# EasyEDA Pro project LUME_PEN_EasyEDA_Project_V1.2_2026-06-28.epro, board PCB6
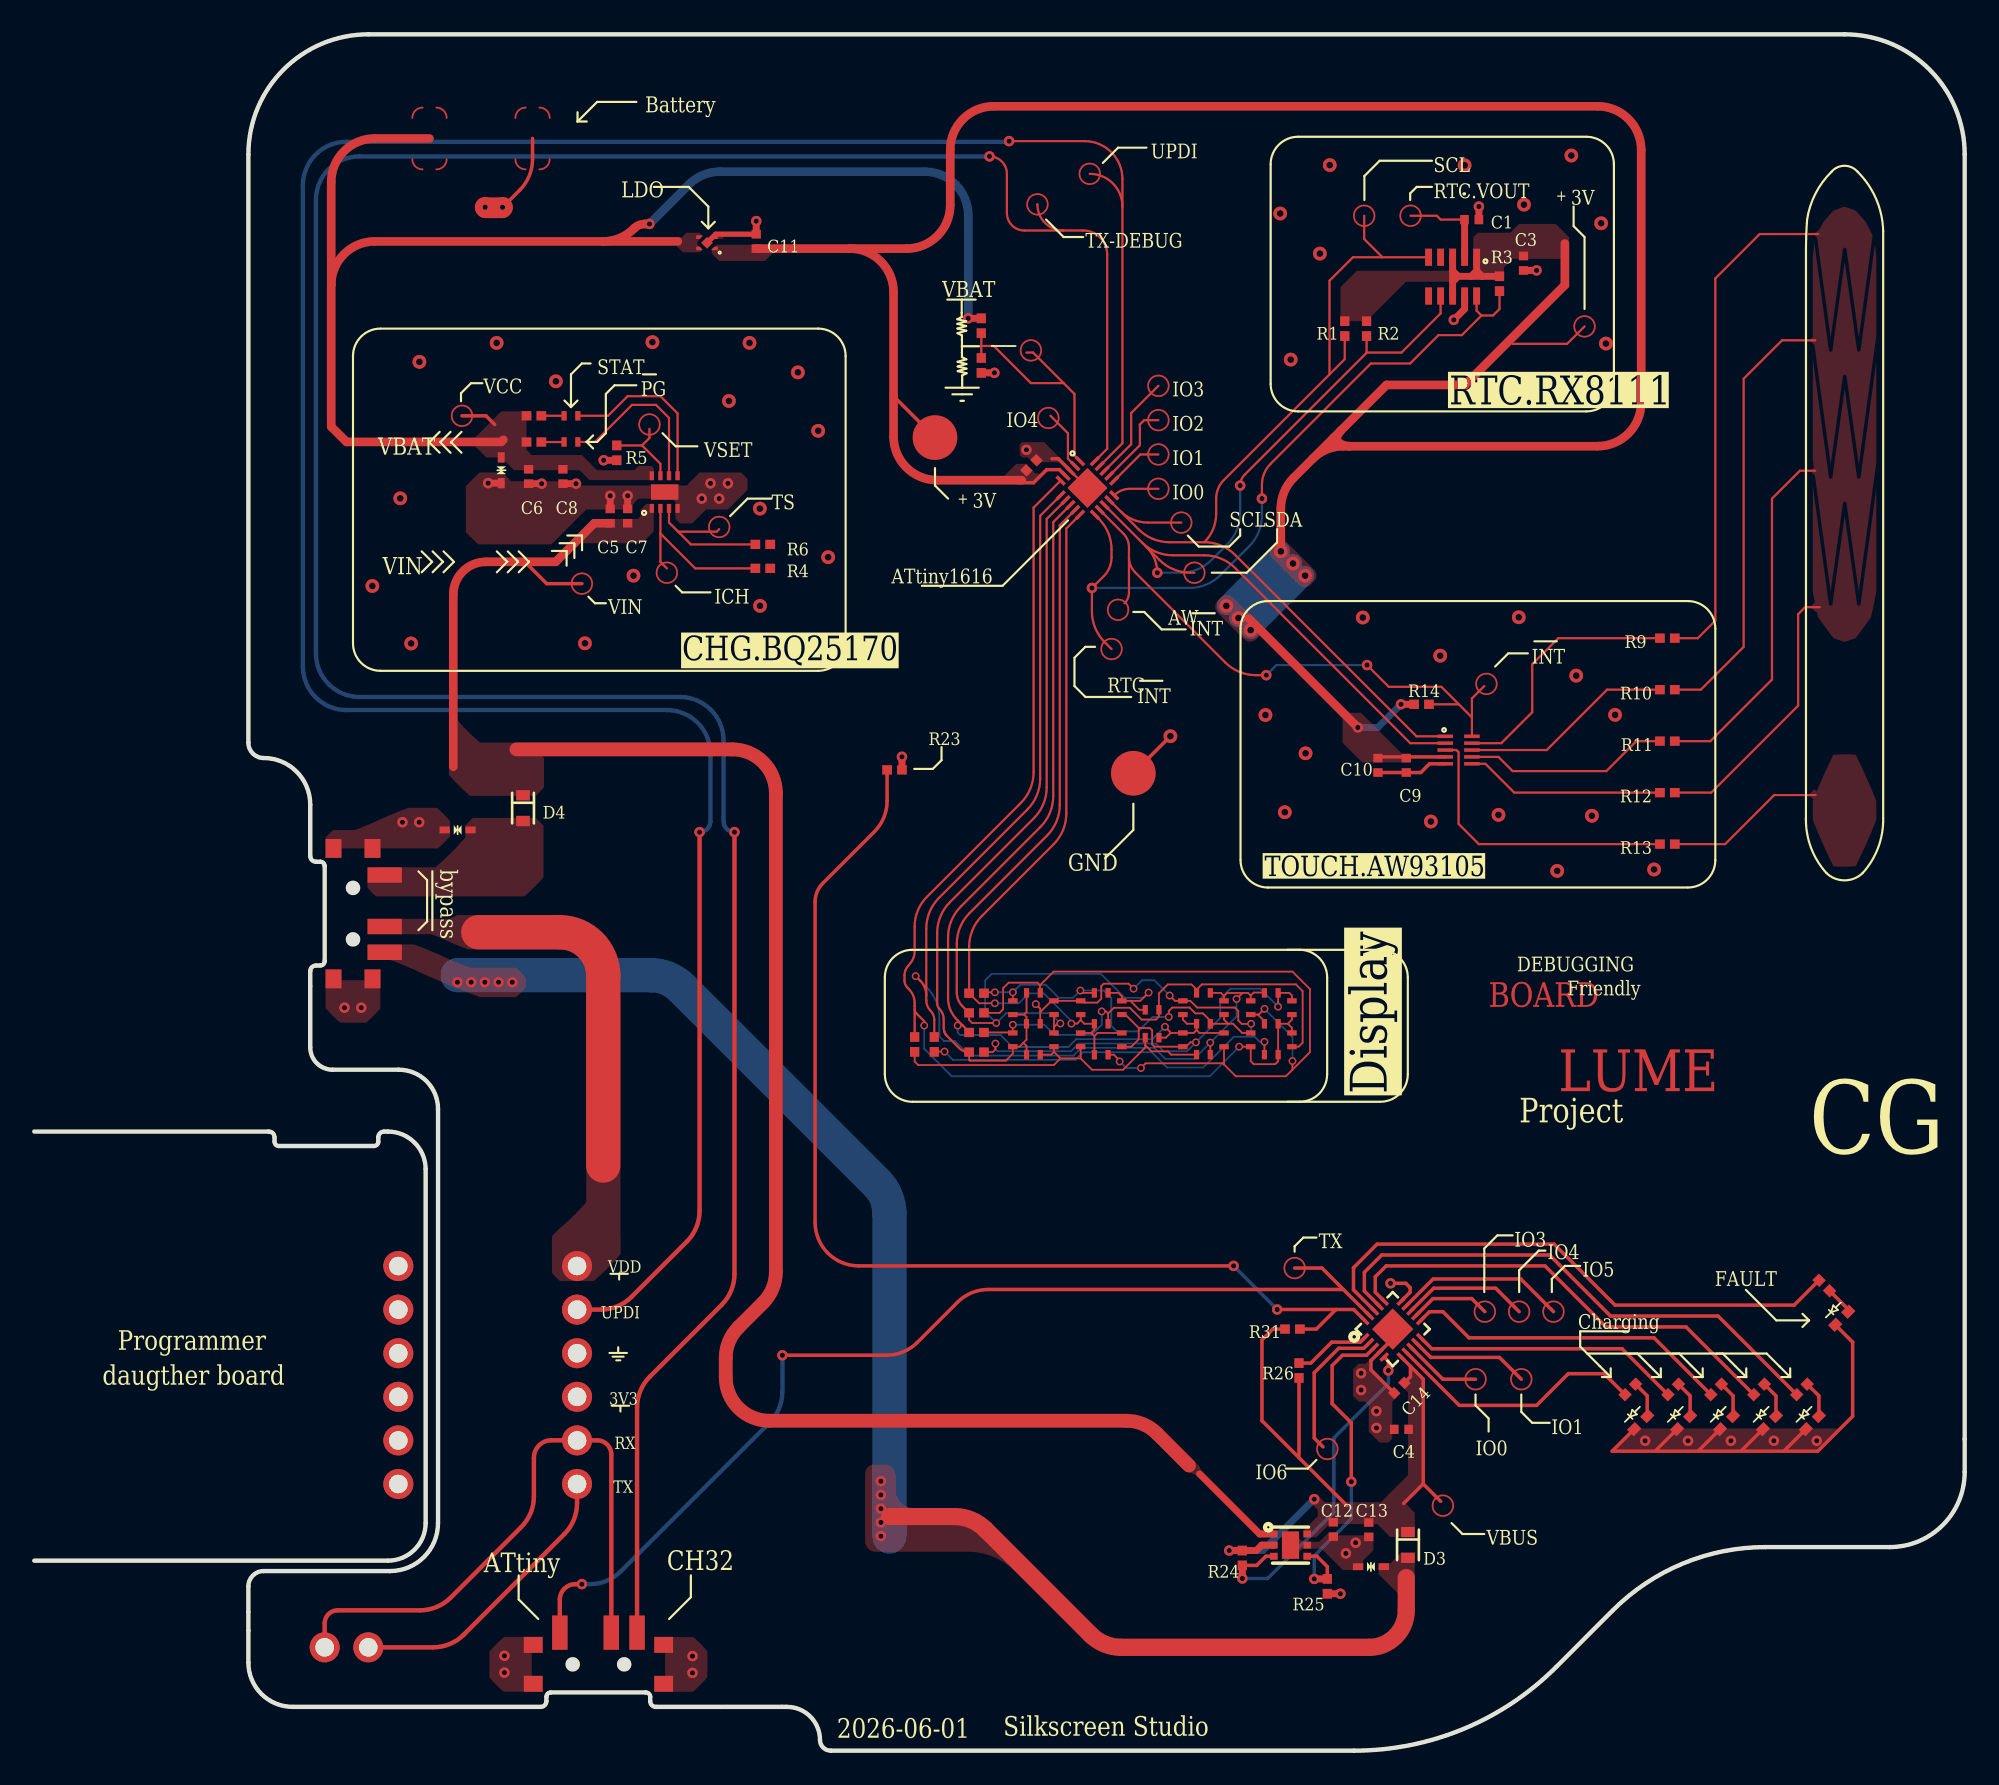
[diagram p7: board, top side]
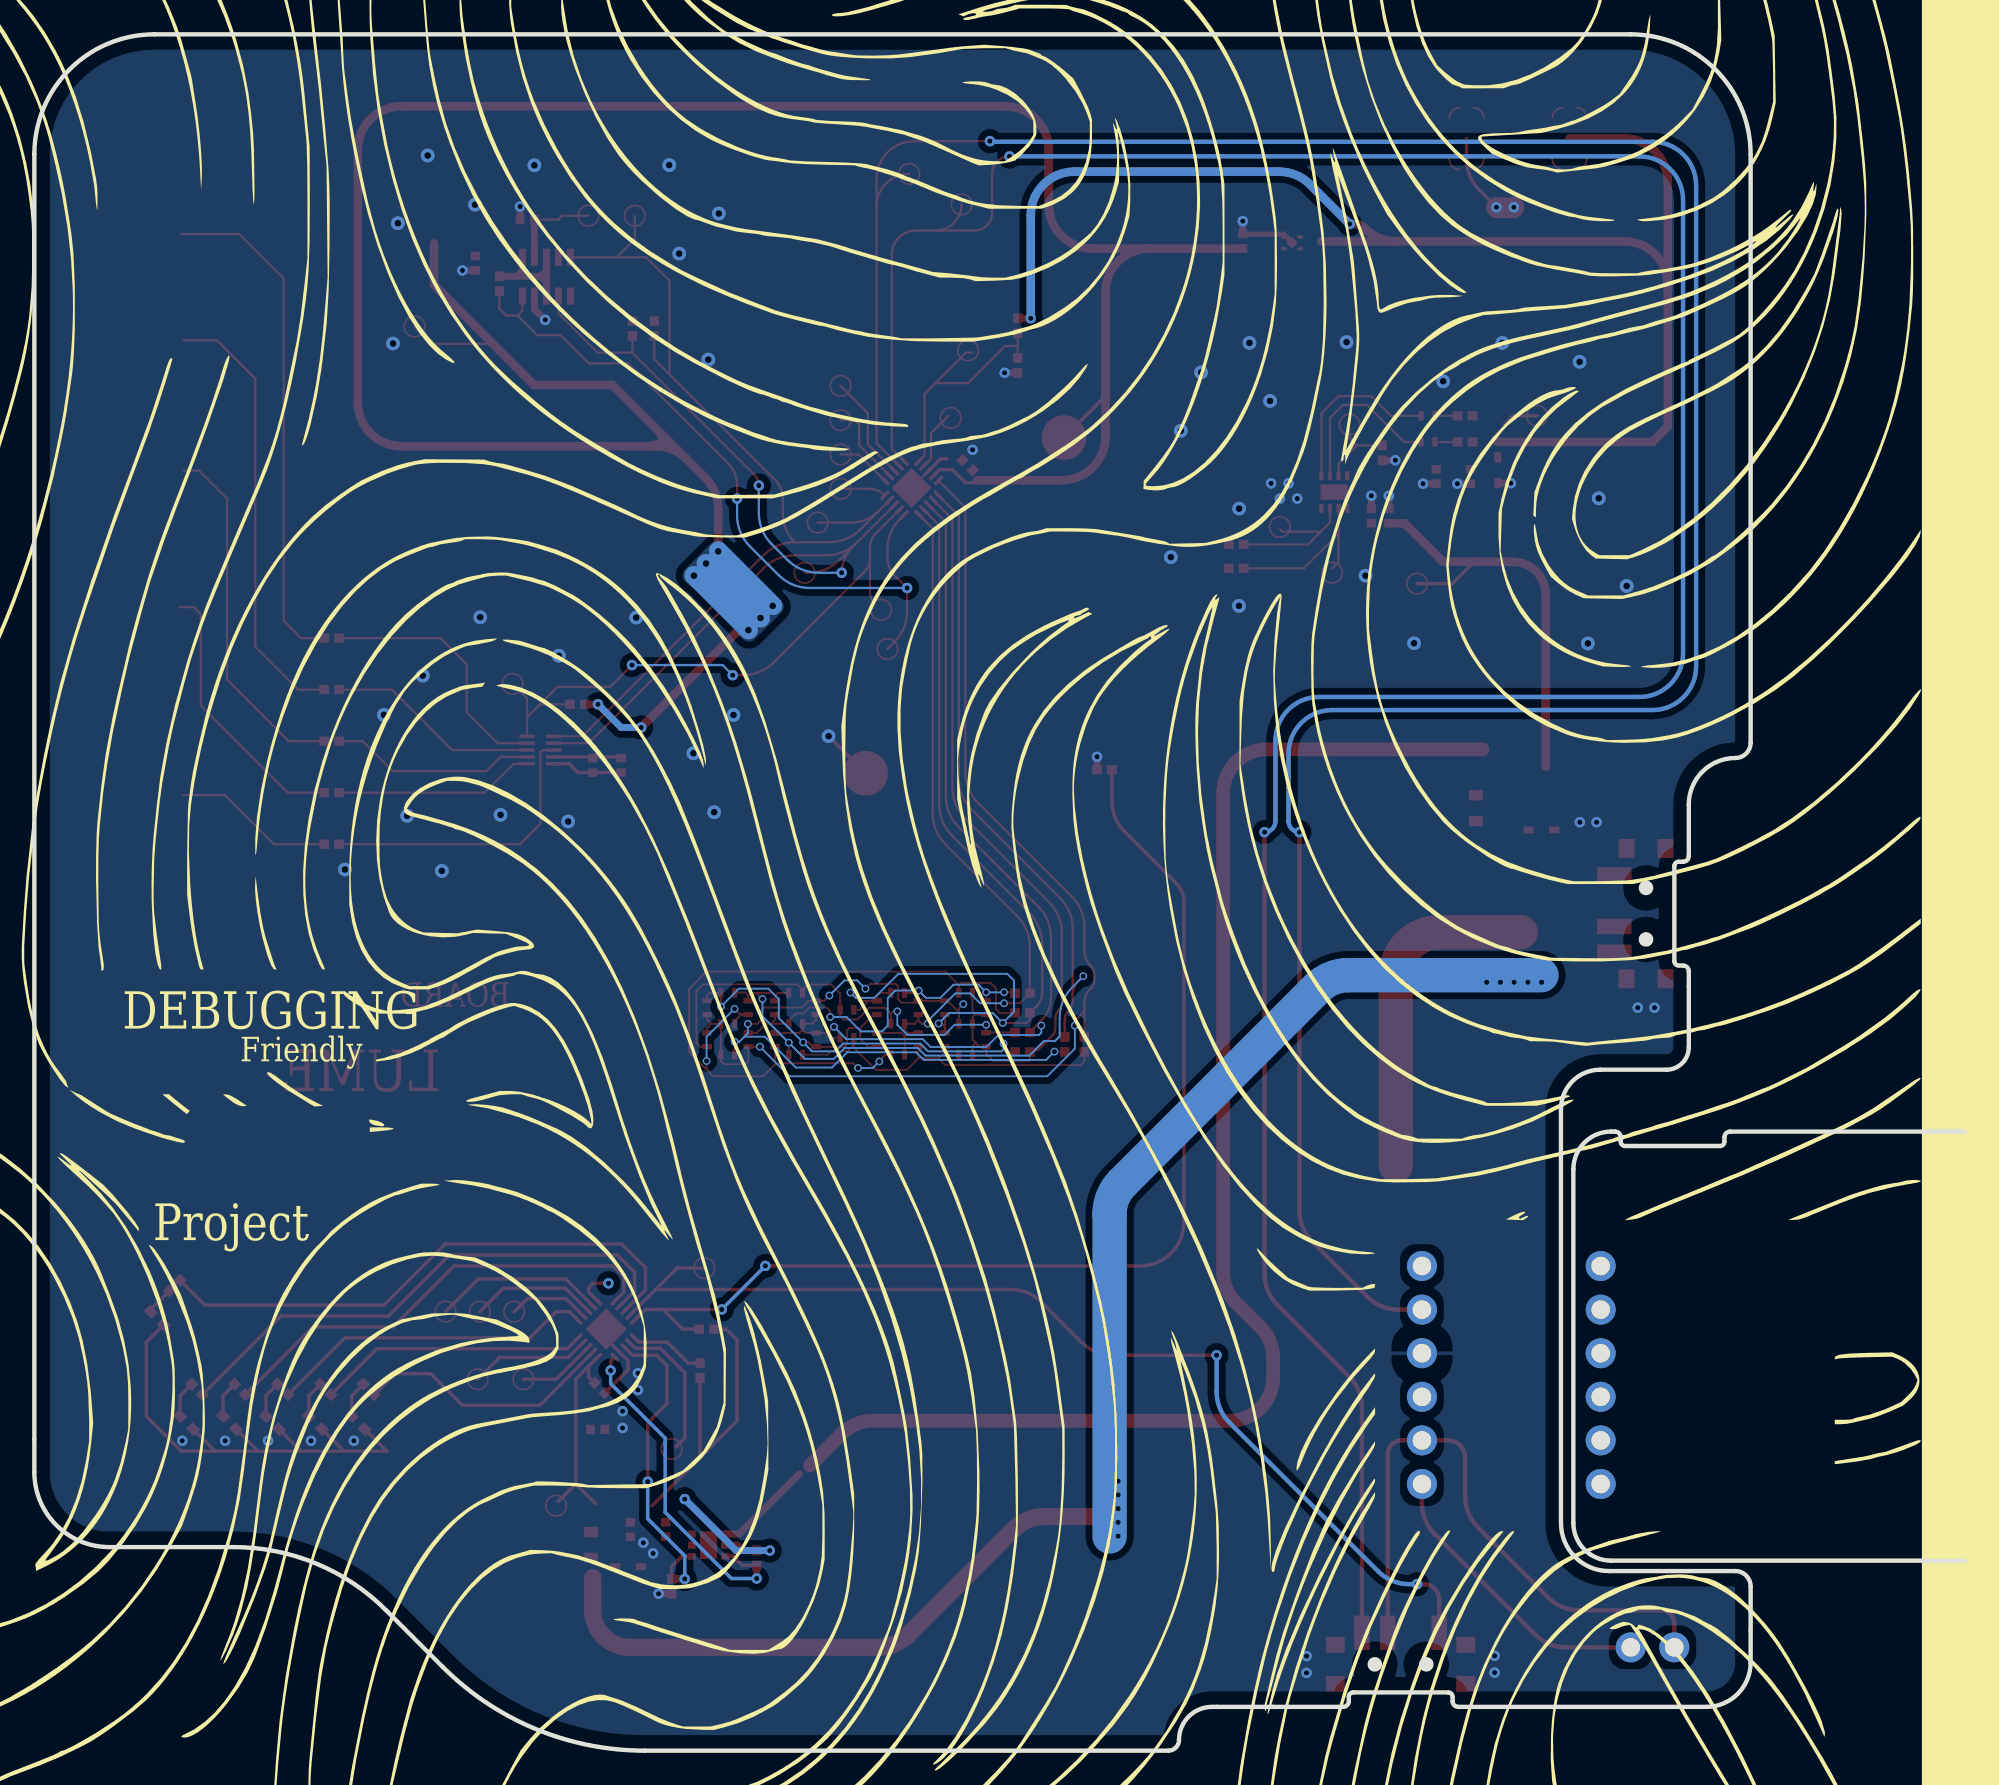
[diagram p8: board, bottom side, seen from below]

Outline 112.47 x 100 mm; copper layers: Top Layer, Bottom Layer. Coordinates in mm from the lower left corner of the outline.
Outline path: 0,36.07 13.66,36.07 arc(13.9,35.97) 14,35.74 14,35.48 arc(14.07,35.3) 14.25,35.23 19.79,35.23 arc(19.97,35.3) 20.04,35.48 20.04,35.74 arc(20.14,35.97) 20.38,36.07 20.6,36.07 arc(22.16,35.43) 22.8,33.87 22.8,13.27 arc(22.16,11.72) 20.6,11.07 0,11.07 ; 12.47,93 12.47,58.72 arc(12.73,58.1) 13.36,57.84 arc(15.28,57.04) 16.08,55.12 16.08,52.12 arc(16.17,51.89) 16.41,51.79 16.66,51.79 arc(16.84,51.72) 16.92,51.54 16.92,46 arc(16.84,45.82) 16.66,45.75 16.41,45.75 arc(16.17,45.65) 16.08,45.41 16.08,40.98 arc(16.46,40.06) 17.38,39.67 21.23,39.67 arc(22.85,39.01) 23.52,37.39 23.52,13.26 arc(22.7,11.28) 20.73,10.47 13.36,10.47 arc(12.73,10.2) 12.47,9.58 12.47,5.13 arc(13.23,3.31) 15.05,2.55 29.5,2.55 arc(29.74,2.65) 29.84,2.88 29.84,3.14 arc(29.91,3.32) 30.09,3.39 35.63,3.39 arc(35.81,3.32) 35.88,3.14 35.88,2.88 arc(35.98,2.65) 36.22,2.55 43.85,2.55 arc(45.21,1.99) 45.78,0.62 arc(45.96,0.18) 46.4,0 76.9,0 arc(83.27,1.27) 88.67,4.87 91.97,8.18 arc(96.05,10.9) 100.87,11.86 108.1,11.86 arc(111.19,13.14) 112.47,16.23 112.47,93 arc(110.42,97.95) 105.47,100 19.47,100 arc(14.52,97.95) 12.47,93
Stack: Top Layer 0.035mm / Dielectric1 1.51mm FR4 er 4.5 / Bottom Layer 0.035mm

## Design rules (mm)
template: Custom Config
spacing copperThickness1oz (default): track to track 0.127, other pairs 0.152 to 0.3
spacing copperThickness2oz: track to track 0.203, other pairs 0.152 to 0.3
track width copperThickness1oz (default): min 0.1, default 0.127, max 2.54
track width copperThickness2oz: min 0.203, default 0.254, max 2.54
differential pair differentialPair (default): width min 0.127, default 0.254, max 2.54; gap min 0.152, default 0.152
via viaSize (default): diameter min 0.45, default 0.61, max 10; hole min 0.3, default 0.305, max 6.3
net GND uses  MODULE_AREA_TOP_GND
pour e1174 uses  MODULE_AREA_TOP_GND

## Placement (name value [footprint] x y rotation side)
C1  1µF  [C0402]  83.75 89.2 0 top
C2  100nF  [C0402]  58.1 74.89 45 top
C3  100nF  [C0402]  86.77 86.66 270 top
C4  100nF  [C0402]  79.66 18.72 180 top
C5  4.7µF  [C0402]  33.55 71.93 90 top
C6  4.7µF  [C0402]  28.8 74.24 270 top
C7  100nF  [C0402]  34.57 71.93 90 top
C8  100nF  [C0402]  30.8 74.24 270 top
C9  100nF  [C0402]  79.94 57.41 270 top
C10  1µF  [C0402]  78.29 57.41 270 top
C11  1µF  [C0402]  42.06 87.94 90 top
C12  100nF  [C0402]  75.69 12.89 270 top
C13  10µF  [C0402]  77.75 12.88 270 top
C14  100nF  [C0402]  79.53 21.13 225 top
D1  LESD5D5.0CT1G  [SOD-523_L1.2-W0.8-LS1.6-BI]  27.2 74.6 90 top
D3  RB520SM-40T2R  [SOD-523F_L1.7-W0.9-LS1.7-RD]  80.04 11.99 270 top
D4  RB520SM-40T2R  [SOD-523F_L1.7-W0.9-LS1.7-RD]  28.47 54.91 270 top
LED1  XL-1005SURC  [LED0402]  31.27 76.25 180 top
LED2  XL-1005SURC  [LED0402]  31.27 77.77 180 top
LED3  XL-1005SURC  [LED0402]  63.37 43.29 270 top
LED4  XL-1005SURC  [LED0402]  63.36 41.42 270 top
LED5  XL-1005SURC  [LED0402]  66.92 41.42 270 top
LED6  XL-1005SURC  [LED0402]  72.07 44.15 0 top
LED7  XL-1005SURC  [LED0402]  73.27 43.29 90 top
LED8  XL-1005SURC  [LED0402]  58.21 44.15 0 top
LED9  XL-1005SURC  [LED0402]  62.16 40.55 0 top
LED10  XL-1005SURC  [LED0402]  69.32 41.42 270 top
LED11  XL-1005SURC  [LED0402]  70.87 43.29 270 top
LED12  XL-1005SURC  [LED0402]  72.07 42.35 180 top
LED13  XL-1005SURC  [LED0402]  57.01 43.29 90 top
LED14  XL-1005SURC  [LED0402]  62.16 44.15 180 top
LED15  XL-1005SURC  [LED0402]  68.12 42.35 0 top
LED16  XL-1005SURC  [LED0402]  69.32 43.29 270 top
LED17  XL-1005SURC  [LED0402]  70.87 41.42 90 top
LED18  XL-1005SURC  [LED0402]  57.01 41.42 90 top
LED19  XL-1005SURC  [LED0402]  65.13 43.17 0 top
LED20  XL-1005SURC  [LED0402]  62.16 42.35 0 top
LED21  XL-1005SURC  [LED0402]  68.12 44.15 180 top
LED22  XL-1005SURC  [LED0402]  73.27 41.42 270 top
LED23  XL-1005SURC  [LED0402]  58.21 42.36 0 top
LED24  XL-1005SURC  [LED0402]  59.41 43.29 90 top
LED25  XL-1005SURC  [LED0402]  60.97 43.29 90 top
LED26  XL-1005SURC  [LED0402]  66.92 43.29 90 top
LED27  XL-1005SURC  [LED0402]  72.07 40.55 180 top
LED28  XL-1005SURC  [LED0402]  58.21 40.55 0 top
LED29  XL-1005SURC  [LED0402]  59.41 41.42 270 top
LED30  XL-1005SURC  [LED0402]  60.96 41.42 270 top
LED31  XL-1005SURC  [LED0402]  65.13 41.54 180 top
LED32  XL-1005SURC  [LED0402]  68.12 40.55 180 top
LED33  XL-1005UWC  [LED0402-RD_YELLOW]  103.6 19.11 45 top
LED34  XL-1005UWC  [LED0402-RD_YELLOW]  101.1 19.11 45 top
LED35  XL-1005UWC  [LED0402-RD_YELLOW]  98.6 19.11 45 top
LED36  XL-1005UWC  [LED0402-RD_YELLOW]  96.1 19.11 45 top
LED37  XL-1005URC  [LED0402-RD_YELLOW]  105.31 25.2 45 top
LED38  XL-1005UWC  [LED0402-RD_YELLOW]  93.6 19.11 45 top
NOREF  -  [Pad_e428]  19.46 6.02 90 top
NOREF#2  -  [Pad_e1015]  63.15 66.47 0 top
NOREF#3  -  [Pad_e1182]  73.43 28.12 0 top
NOREF#4  -  [Pad_e1034]  39.9 71.3 0 top
NOREF#5  -  [Pad_e272]  82.07 14.28 0 top
NOREF#6  -  [Pad_e960]  84.61 62.15 0 top
NOREF#7  -  [Pad_e1010]  66.83 71.55 0 top
NOREF#8  -  [Pad_e1011]  67.59 68.63 0 top
NOREF#9  -  [Pad_e2385]  64.03 56.95 0 top
NOREF#10  -  [Pad_e260]  21.21 15.54 0 top
NOREF#11  -  [Pad_e2391]  52.48 76.5 0 top
NOREF#12  -  [Pad_e407]  31.62 15.54 0 top
NOREF#13  -  [Pad_e426]  31.62 28.24 0 top
NOREF#14  -  [Pad_e269]  21.21 25.7 0 top
NOREF#15  -  [Pad_e1650]  90.32 82.98 0 top
NOREF#16  -  [Pad_e1630]  77.48 89.43 0 top
NOREF#17  -  [Pad_e1123]  24.92 77.77 0 top
NOREF#18  -  [Pad_e1371]  58.06 81.58 0 top
NOREF#19  -  [Pad_e624]  86.64 21.64 0 top
NOREF#20  -  [Pad_e1033]  36.86 68.63 0 top
NOREF#21  -  [Pad_e1259]  65.49 75.52 0 top
NOREF#22  -  [Pad_e1261]  65.49 79.52 0 top
NOREF#23  -  [Pad_e1252]  84.51 25.58 0 top
NOREF#24  -  [Pad_e268]  21.21 23.16 0 top
NOREF#25  -  [Pad_e1024]  61.49 91.87 0 top
NOREF#26  -  [Pad_e266]  21.21 20.62 0 top
NOREF#27  -  [Pad_e425]  31.62 25.7 0 top
NOREF#28  -  [Pad_e28]  29.03 93.93 0 top
NOREF#29  -  [Pad_e423]  31.62 20.62 0 top
NOREF#30  -  [Pad_e265]  21.21 18.08 0 top
NOREF#31  -  [Pad_e1629]  80.18 89.43 0 top
NOREF#32  -  [Pad_e424]  31.62 23.16 0 top
NOREF#33  -  [Pad_e1023]  58.45 90.09 0 top
NOREF#34  -  [Pad_e420]  31.62 18.08 0 top
NOREF#35  -  [Pad_e1375]  59.08 77.65 0 top
NOREF#36  -  [Pad_e434]  16.92 6.02 90 top
NOREF#37  -  [Pad_e280]  21.21 28.24 0 top
NOREF#38  -  [Pad_e1128]  31.9 68 0 top
NOREF#39  -  [Pad_e1260]  65.49 77.52 0 top
NOREF#40  -  [Pad_e1765]  65.49 73.52 180 top
NOREF#41  -  [Pad_e27]  23.02 93.93 0 top
NOREF#42  -  [Pad_e1016]  62.76 64.19 0 top
NOREF#43  -  [Pad_e1253]  86.51 25.58 0 top
NOREF#44  -  [Pad_e1251]  88.51 25.58 0 top
NOREF#45  -  [Pad_e1035]  35.84 77.27 0 top
NOREF#46  -  [Pad_e622]  83.97 21.64 0 top
NOREF#47  -  [Pad_e1361]  75.34 17.58 0 top
R1  4.7K  [R0402]  76.35 82.86 90 top
R2  4.7K  [R0402]  77.62 82.86 90 top
R3  20K  [R0402]  85.37 85.47 90 top
R4  24K  [R0402]  42.44 68.88 180 top
R5  27K  [R0402]  33.94 75.62 90 top
R6  10K  [R0402]  42.44 70.28 180 top
R7  10K  [R0402]  29.11 76.25 180 top
R8  10K  [R0402]  29.11 77.77 180 top
R9  0  [R0402]  95.15 64.82 180 top
R10  0  [R0402]  95.15 61.82 180 top
R11  0  [R0402]  95.15 58.82 180 top
R12  0  [R0402]  95.15 55.82 180 top
R13  0  [R0402]  95.15 52.82 0 top
R14  20K  [R0402]  80.83 60.97 180 top
R15  680  [R0402]  54.9 40.7 180 top
R16  680  [R0402]  54.9 42.99 180 top
R17  680  [R0402]  54.9 44.13 180 top
R18  680  [R0402]  54.9 41.84 180 top
R19  680  [R0402]  52.44 41.15 90 top
R20  680  [R0402]  51.29 41.15 90 top
R21  100K  [R0402]  55.18 83.02 90 top
R22  200K  [R0402]  55.18 80.71 90 top
R23  20K  [R0402]  50.12 57.14 180 top
R24  100K  [R0402]  70.38 11.23 90 top
R25  20K  [R0402]  75.34 9.58 90 top
R26  10K  [R0402]  73.69 22.15 270 top
R27  330  [R0402]  102.99 21.05 45 top
R28  330  [R0402]  100.49 21.05 45 top
R29  330  [R0402]  97.99 21.05 45 top
R30  330  [R0402]  95.49 21.05 45 top
R31  20K  [R0402]  73.31 24.56 180 top
R32  330  [R0402]  104.29 27.1 315 top
R33  330  [R0402]  92.99 21.05 45 top
SW3  MK-12C02-G015  [SW-SMD_G-SWITCH_MK-12C02-G015]  18.92 48.77 270 top
SW4  MK-12C02-G015  [SW-SMD_G-SWITCH_MK-12C02-G015]  32.87 5.38 0 top
TVS1  LESD5D5.0CT1G  [SOD-523_L1.2-W0.8-LS1.6-BI]  77.88 10.72 0 top
TVS2  LESD5D5.0CT1G  [SOD-523_L1.2-W0.8-LS1.6-BI]  24.66 53.64 0 top
U1  RX8111CE B  [OSC-SMD_10P-L3.2-W2.5-BL-1]  82.64 85.88 180 top
U2  ATTINY1616-MNR  [QFN-20_L3.0-W3.0-P0.40-BL-EP1.7]  61.36 73.57 225 top
U3  BQ25170DSGR  [WSON-8_L2.0-W2.0-P0.50-TL-EP]  36.73 73.33 90 top
U4  -  [AW93105DNR]  82.98 58.3 270 top
U5  LP5907SNX-3.0/NOPB  [X2SON-4_L1.0-W1.0-P0.65-BL-EP]  39.19 87.85 90 top
U6  TPS2553DRVR-1  [WSON-6_L2.0-W2.0-P0.65-BL-EP]  73.19 11.98 270 top
U7  CH32V003F4U6  [QFN-20_L3.0-W3.0-P0.40-TL-EP1.7]  79.15 24.56 45 top

## Footprints (pads in the part's own frame, mm; a bottom-side part is the same pattern mirrored in y, then rotated)
AW93105DNR
  rect 0.2x0.905 smd: 1(-0.8,-0.777) 2(-0.4,-0.777) 3(0,-0.777) 4(0.4,-0.777) 5(0.8,-0.777) 6(0.8,0.777) 7(0.4,0.777) 8(0,0.777) 9(-0.4,0.777) 10(-0.8,0.777)
C0402
  rect 0.5x0.54 smd: 1(-0.42,0) 2(0.42,0)
LED0402
  rect 0.3x0.55 smd: 1(-0.4,0) 2(0.4,0)
LED0402-RD_YELLOW
  rect 0.636x0.54 smd: 1(-0.538,0) 2(0.538,0)
OSC-SMD_10P-L3.2-W2.5-BL-1
  rect 0.4x1 smd: 1(-1.4,-1.13) 2(-0.7,-1.13) 3(0,-1.13) 4(0.7,-1.13) 5(1.4,-1.13) 6(1.4,1.13) 7(0.7,1.13) 8(0,1.13) 9(-0.7,1.13) 10(-1.4,1.13)
Pad_e27
  custom 2x3.6 smd: 24(0,0)
Pad_e28
  custom 2x3.6 smd: 25(0,0)
Pad_e260
  rrect 1.75x1.75 hole 1.08: 4(0,0)
Pad_e265
  rrect 1.75x1.75 hole 1.08: 5(0,0)
Pad_e266
  rrect 1.75x1.75 hole 1.08: 5(0,0)
Pad_e268
  rrect 1.75x1.75 hole 1.08: 3(0,0)
Pad_e269
  rrect 1.75x1.75 hole 1.08: 2(0,0)
Pad_e272
  custom 1.2x1.2 smd: 23(0,0)
Pad_e280
  rrect 1.75x1.75 hole 1.08: 2(0,0)
Pad_e407
  rrect 1.75x1.75 hole 1.08: 4(0,0)
Pad_e420
  rrect 1.75x1.75 hole 1.08: 5(0,0)
Pad_e423
  rrect 1.75x1.75 hole 1.08: 5(0,0)
Pad_e424
  rrect 1.75x1.75 hole 1.08: 3(0,0)
Pad_e425
  rrect 1.75x1.75 hole 1.08: 2(0,0)
Pad_e426
  rrect 1.75x1.75 hole 1.08: 2(0,0)
Pad_e428
  rrect 1.75x1.75 hole 1.08: 4(0,0)
Pad_e434
  rrect 1.75x1.75 hole 1.08: 5(0,0)
Pad_e622
  custom 1.2x1.2 smd: 23(0,0)
Pad_e624
  custom 1.2x1.2 smd: 23(0,0)
Pad_e960
  custom 1.2x1.2 smd: 23(0,0)
Pad_e1010
  custom 1.2x1.2 smd: 22(0,0)
Pad_e1011
  custom 1.2x1.2 smd: 22(0,0)
Pad_e1015
  custom 1.2x1.2 smd: 22(0,0)
Pad_e1016
  custom 1.2x1.2 smd: 22(0,0)
Pad_e1023
  custom 1.2x1.2 smd: 22(0,0)
Pad_e1024
  custom 1.2x1.2 smd: 22(0,0)
Pad_e1033
  custom 1.2x1.2 smd: 1(0,0)
Pad_e1034
  custom 1.2x1.2 smd: 22(0,0)
Pad_e1035
  custom 1.2x1.2 smd: 23(0,0)
Pad_e1123
  custom 1.2x1.2 smd: 23(0,0)
Pad_e1128
  custom 1.2x1.2 smd: 23(0,0)
Pad_e1182
  custom 1.2x1.2 smd: 23(0,0)
Pad_e1251
  custom 1.2x1.2 smd: 23(0,0)
Pad_e1252
  custom 1.2x1.2 smd: 23(0,0)
Pad_e1253
  custom 1.2x1.2 smd: 23(0,0)
Pad_e1259
  custom 1.2x1.2 smd: 22(0,0)
Pad_e1260
  custom 1.2x1.2 smd: 22(0,0)
Pad_e1261
  custom 1.2x1.2 smd: 22(0,0)
Pad_e1361
  custom 1.2x1.2 smd: 23(0,0)
Pad_e1371
  custom 1.2x1.2 smd: 22(0,0)
Pad_e1375
  custom 1.2x1.2 smd: 22(0,0)
Pad_e1629
  custom 1.2x1.2 smd: 23(0,0)
Pad_e1630
  custom 1.2x1.2 smd: 23(0,0)
Pad_e1650
  custom 1.2x1.2 smd: 23(0,0)
Pad_e1765
  custom 1.2x1.2 smd: 22(0,0)
Pad_e2385
  round 2.6 smd: 2(0,0)
Pad_e2391
  round 2.6 smd: 2(0,0)
QFN-20_L3.0-W3.0-P0.40-BL-EP1.7
  rect 0.2x0.665 smd: 1(-0.8,-1.407) 2(-0.4,-1.407) 3(0,-1.407) 4(0.4,-1.407) 5(0.8,-1.407) 11(0.8,1.407) 12(0.4,1.407) 13(0,1.407) 14(-0.4,1.407) 15(-0.8,1.407)
  rect 0.665x0.2 smd: 6(1.407,-0.8) 7(1.407,-0.4) 8(1.407,0) 9(1.407,0.4) 10(1.407,0.8) 16(-1.407,0.8) 17(-1.407,0.4) 18(-1.407,0) 19(-1.407,-0.4) 20(-1.407,-0.8)
  rect 1.65x1.65 smd: 21(0,0)
QFN-20_L3.0-W3.0-P0.40-TL-EP1.7
  rect 0.6x0.2 smd: 1(-1.5,0.8) 2(-1.5,0.401) 3(-1.5,0) 4(-1.5,-0.4) 5(-1.5,-0.8) 11(1.5,-0.8) 12(1.5,-0.4) 13(1.5,0) 14(1.5,0.401) 15(1.5,0.8)
  rect 0.2x0.6 smd: 6(-0.8,-1.5) 7(-0.4,-1.5) 8(0,-1.5) 9(0.4,-1.5) 10(0.799,-1.5) 16(0.8,1.5) 17(0.4,1.5) 18(0,1.5) 19(-0.4,1.5) 20(-0.8,1.5)
  rect 1.7x1.7 smd: 21(0,0)
R0402
  rect 0.566x0.54 smd: 1(-0.433,0) 2(0.433,0)
SOD-523_L1.2-W0.8-LS1.6-BI
  rect 0.6x0.4 smd: 1(-0.75,0) 2(0.75,0)
SOD-523F_L1.7-W0.9-LS1.7-RD
  rect 0.6x0.8 smd: 1(-0.75,0) 2(0.75,0)
SW-SMD_G-SWITCH_MK-12C02-G015
  rect 0.9x2 smd: 1(-2.25,1.49) 2(0.75,1.49) 3(2.25,1.49)
  rect 1.1x0.93 smd: 4(3.8,0.779) 5(3.8,-1.49) 6(-3.8,-1.49) 7(-3.8,0.779)
WSON-6_L2.0-W2.0-P0.65-BL-EP
  rect 0.4x0.45 smd: 1(-0.65,-0.975) 2(0,-0.975) 3(0.65,-0.975) 4(0.65,0.975) 5(0,0.975) 6(-0.65,0.975)
  rect 1.6x1 smd: 7(0,0)
WSON-8_L2.0-W2.0-P0.50-TL-EP
  rect 0.521x0.25 smd: 1(-0.95,0.75) 2(-0.95,0.25) 3(-0.95,-0.25) 4(-0.95,-0.75) 5(0.95,-0.75) 6(0.95,-0.25) 7(0.95,0.25) 8(0.95,0.75)
  rect 0.9x1.6 smd: 9(0,0)
X2SON-4_L1.0-W1.0-P0.65-BL-EP
  custom 0.21x0.36 smd: 1(-0.33,-0.45) 2(0.33,-0.45) 3(0.33,0.45) 4(-0.33,0.45)
  rect 0.48x0.48 smd rot 135: 5(0,0)

## Nets
3.0V: C2.1 C3.1 C9.1 C10.1 C11.1 NOREF#11.2 NOREF#15.23 R1.2 R2.2 R3.2 R14.2 U1.1 U1.3 U1.8 U2.4 U4.4 U5.1
5V_IN: D3.2 SW3.3 TVS1.2
5V_POGO_EN: R25.2 U6.4 U7.3
+3.3V: NOREF#26.5 NOREF#29.5
GND: C1.2 C2.2 C3.2 C4.2 C5.2 C6.2 C7.2 C8.2 C9.2 C10.2 C11.2 C12.2 C13.2 C14.2 D1.1 LED33.1 LED34.1 LED35.1 LED36.1 LED37.1 LED38.1 NOREF#9.2 NOREF#24.3 NOREF#28.25 NOREF#32.3 R4.1 R5.1 R6.1 R22.1 R23.1 R25.1 SW3.4 SW3.5 SW3.6 SW3.7 SW4.4 SW4.5 SW4.6 SW4.7 TVS1.1 TVS2.1 U1.9 U2.3 U2.21 U3.4 U3.9 U4.5 U5.2 U5.5 U6.5 U6.7 U7.4 U7.21
VBAT.SENSE: NOREF#18.22 R21.1 R22.2 U2.1
VBUS: C4.1 C12.1 C13.1 C14.1 D3.1 NOREF#5.23 R24.2 R26.2 R31.2 U6.2 U6.6 U7.6
VCC: C6.1 C8.1 D1.2 NOREF#17.23 NOREF#41.24 R7.2 R8.2 R21.2 U3.8 U5.3 U5.4
VDD.DEBUG: NOREF#13.2 NOREF#37.2 SW3.2
VIN: C5.1 C7.1 D4.1 NOREF#38.23 U3.1 U6.1
VIN.USB: D4.2 SW3.1 TVS2.2
AW.NINT: NOREF#2.22 NOREF#6.23 R14.1 U2.12 U4.10
C0: R11.1
C1: R12.1
C2: R13.2
C3: R10.1
C4: R9.1
DEBUG.TX: NOREF#33.22 SW4.3 U2.20
DEBUG.TX.CHG: NOREF#3.23 SW4.1 U7.19
DEBUG.TX.PROBE: NOREF#30.5 NOREF#34.5 NOREF#36.5 SW4.2
EVIN: U1.6
GPIO0: NOREF#40.22 U2.15
GPIO1: NOREF#21.22 U2.16
GPIO2: NOREF#39.22 U2.17
GPIO3: NOREF#22.22 U2.18
GPIO4: NOREF#35.22 U2.2
IO0: NOREF#46.23 U7.8
IO1: NOREF#19.23 U7.9
IO3: NOREF#23.23 U7.12
IO4: NOREF#43.23 U7.13
IO5: NOREF#44.23 U7.14
IO6: NOREF#47.23 U7.2
L1: LED8.1 LED13.1 LED18.1 LED23.1 LED28.1 R15.2 U2.7
L2: LED3.1 LED14.1 LED19.1 LED24.1 LED29.1 R16.2 U2.9
L3: LED4.1 LED9.1 LED20.1 LED25.1 LED30.1 R17.2 U2.10
L4: LED5.1 LED10.1 LED15.1 LED26.1 LED31.1 R18.2 U2.8
L5: LED6.1 LED11.1 LED16.1 LED21.1 LED32.1 R19.2 U2.6
L6: LED7.1 LED12.1 LED17.1 LED22.1 LED27.1 R20.2 U2.5
LED_R: R32.1 U7.18
LED_W1: R33.1 U7.7
LED_W2: R27.1 U7.17
LED_W3: R28.1 U7.16
LED_W4: R29.1 U7.11
LED_W5: R30.1 U7.10
NFAULT: R24.1 U6.3 U7.5
RTC.NINT: NOREF#42.22 R3.1 U1.10 U2.11
RTC.VOUT: C1.1 NOREF#31.23 U1.2
SCL: NOREF#7.22 NOREF#16.23 R1.1 U1.5 U2.14 U4.1
SDA: NOREF#8.22 R2.1 U1.7 U2.13 U4.2
SENSE: R23.2 R31.1 U7.20
SWIO: U7.15
TX: NOREF.4 NOREF#10.4 NOREF#12.4
UPDI: NOREF#14.2 NOREF#25.22 NOREF#27.2 U2.19
VSET: NOREF#45.23 R5.2 U3.7
$1N3166: NOREF#20.1 R4.2 U3.2
$1N3167: NOREF#4.22 R6.2 U3.3
$1N3187: LED2.2 R8.1
$1N3197: LED2.1 U3.5
$1N3198: LED1.2 R7.1
$1N3199: LED1.1 U3.6
$1N3232: R12.2 U4.6
$1N3233: R11.2 U4.7
$1N3236: R10.2 U4.8
$1N3237: R9.2 U4.9
$1N3255: R13.1 U4.3
$1N4483: R26.1 U7.1
$1N4489: LED38.2 R33.2
$1N4492: LED33.2 R27.2
$1N4495: LED34.2 R28.2
$1N4498: LED35.2 R29.2
$1N4501: LED36.2 R30.2
$1N4505: LED37.2 R32.2
$1N4813: LED3.2 LED4.2 LED5.2 LED6.2 LED7.2 R15.1
$1N4816: LED8.2 LED9.2 LED10.2 LED11.2 LED12.2 R16.1
$1N4817: LED18.2 LED19.2 LED20.2 LED21.2 LED22.2 R18.1
$1N4818: LED13.2 LED14.2 LED15.2 LED16.2 LED17.2 R17.1
$1N4825: LED23.2 LED24.2 LED25.2 LED26.2 LED27.2 R19.1
$1N5378: LED28.2 LED29.2 LED30.2 LED31.2 LED32.2 R20.1

Pads without a net: U1 4

## Via types
v1: diameter 0.61, hole 0.305, Top Layer to Bottom Layer, 74 vias
v2: diameter 0.8, hole 0.4, Top Layer to Bottom Layer, 45 vias
v3: diameter 0.45, hole 0.3, Top Layer to Bottom Layer, 31 vias

## Routing (per net, layer and track width the routed paths; a pad name or vN(x,y) marks a point on that pad's centre or on a via; arc(x,y) is an arc through that point)
3.0V: length 193.9
  Top Layer w0.127: NOREF#15.23 89.31,81.97 86.13,81.97
  Top Layer w0.2: NOREF#11.2 50.06,78.92 ; U2.4 59.73,74.64 58.99,74.64 58.22,73.88 57.45,73.88 57.3,74.02 ; 78.29,57.83 78.35,57.9 U4.4
  Top Layer w0.4: 82.64,86.22 U1.3 ; 82.64,86.22 82.64,85.58 ; 82.64,86.22 82.96,85.9 ; 82.64,85.58 82.96,85.9 ; 82.64,85.58 U1.8 ; v1(79.63,60.97) R14.2 ; 82.96,85.9 83.72,85.9 ; 85.37,85.95 85.32,85.9 84.35,85.9 ; 84.04,86.22 U1.1 ; 84.04,86.22 84.35,85.9 ; 84.04,86.22 83.72,85.9 ; 84.35,85.9 83.72,85.9
  Top Layer w0.5: 75.71,76.49 74.47,75.26 ; 75.71,76.49 75.88,76.32 ; 75.71,76.49 76.12,76.9 ; 74.47,75.26 73.37,74.16 arc(72.82,73.33) 72.63,72.36 v2(72.63,69.87) ; 74.47,75.26 arc(75.3,75.81) 76.27,76 76.65,76 ; 89.18,87.81 89.18,85.39 83.36,79.57 78.78,79.57 76.12,76.9 ; v1(77.12,59.61) 70.76,65.96 ; 76.65,76 91.09,76 arc(92.88,76.75) 93.62,78.54 93.62,93.27 arc(92.88,95.07) 91.09,95.81 55.91,95.81 arc(54.11,95.07) 53.37,93.27 53.37,90.06 arc(52.62,88.26) 50.83,87.52 47.52,87.52 ; 76.65,76 arc(76.23,76.09) 75.88,76.32 ; 57.54,74.02 52.6,74.02 arc(50.81,74.77) 50.06,76.56 50.06,84.97 arc(49.32,86.77) 47.52,87.52 ; 75.88,76.32 arc(75.94,76.64) 76.12,76.9 ; C11.1 47.52,87.52
  Bottom Layer w0.4: v1(77.12,59.61) 78.28,59.61 v1(79.63,60.97)
  Bottom Layer w1.1: v2(70.16,65.99) v2(73.33,69.17) ; 70.86,65.3 74.04,68.48 ; 69.45,66.72 72.62,69.89
  vias: v2(69.45,66.7) v2(70.87,65.28) v2(74.04,68.46)
5V_IN: length 86.3
  Top Layer w1: 49.84,13.64 53.61,13.64 arc(54.58,13.45) 55.41,12.9 61.54,6.76 arc(62.36,6.21) 63.34,6.02 77.78,6.02 arc(79.3,6.65) 79.94,8.18 79.94,10.08
  Bottom Layer w2: 49.82,12.48 49.82,31.28 arc(49.63,32.25) 49.08,33.08 37.71,44.44 arc(36.89,44.99) 35.92,45.19 24.66,45.19
  vias: v1(24.65,44.77) v1(25.45,44.77) v1(26.25,44.77) v1(27.05,44.77) v1(27.85,44.77) v1(49.33,15.7) v1(49.33,14.9) v1(49.33,14.1) v1(49.33,13.3) v1(49.33,12.5)
5V_POGO_EN: length 19.6
  Top Layer w0.2: 78.09,23.5 77.62,23.04 76.22,23.04 75.62,22.44 75.62,20.22 76.73,19.1 v1(76.73,15.67) ; U6.4 74.73,11.33 75.34,10.72 R25.2
  Top Layer w0.4: v1(74.57,10.01) R25.2
  Bottom Layer w0.2: v1(74.57,10.01) 74.57,11.35 76.73,13.51 v1(76.73,15.67)
GND: length 64
  Top Layer w0.127: U2.3 U2.21
  Top Layer w0.2: 59.3,75.27 59.66,75.27 U2.3 ; v2(66.19,59.11) 64.67,57.58 63.78,57.58 ; U7.21 79.15,24 U7.4 77.88,22.73 77.88,22.19 C14.2 ; LED33.1 101.94,17.45 ; 101.94,17.45 103.91,17.45 105.94,19.48 105.94,23.8 LED37.1 ; 101.94,17.45 99.44,17.45 ; 96.94,17.45 94.44,17.45 ; 96.94,17.45 99.44,17.45 ; 96.94,17.45 LED35.1 ; 94.44,17.45 91.94,17.45 LED38.1 ; 94.44,17.45 LED36.1 ; 99.44,17.45 LED34.1 ; U4.5 81.29,57.5 80.79,56.99 C9.2 C10.2 ; NOREF#28.25 29.03,92.72 arc(28.83,91.75) 28.28,90.93 v1(27.28,89.92)
  Top Layer w0.3: C11.2 39.7,88.35 U5.5
  Top Layer w0.4: v1(76.1,9.14) R25.1 ; 86.77,86.25 v1(87.53,86.25) ; v1(29.56,73.82) C6.2 ; v1(31.56,73.82) C8.2 ; v1(50.55,57.91) R23.1 ; v1(26.44,73.85) D1.1 ; 58.39,75.21 58.39,75.19 ; v1(33.17,75.18) R5.1 ; v1(33.55,73.11) C5.2 ; v1(55.94,80.28) R22.1 ; v1(84.17,89.97) C1.2 ; v1(34.57,73.11) C7.2 ; v1(82.7,83.36) 83.34,84 U1.9 ; v1(42.06,89.12) C11.2
  Top Layer w1.2: v1(27.28,89.92) 27.25,89.89 26.3,89.89 v1(26.27,89.92)
  vias: v1(18.07,43.29) v1(19.05,43.29) v1(21.45,54.09) v1(22.43,54.09) v1(27.39,5.53) v1(27.39,4.55) v1(38.35,5.51) v1(38.35,4.53) v1(38.89,72.95) v1(39.4,73.84) v1(39.9,72.95) v1(40.41,73.84) v1(57.81,75.79) v1(76.42,11.49) v1(76.99,12.12) v1(77.31,21.99) v1(77.31,21.01) v1(78.2,19.78) v1(78.2,18.8) v1(93.85,18.06) v1(96.35,18.06) v1(98.85,18.06) v1(101.35,18.06) v1(103.85,18.06) v2(19.7,67.86) v2(21.32,72.97) v2(21.95,64.51) v2(22.44,80.92) v2(26.94,82.02) v2(30.39,79.78) v2(32.08,64.52) v2(34.91,68.46) v2(36.02,82.07) v2(40.47,78.64) v2(41.67,82.02) v2(42.28,72.37) v2(42.28,66.7) v2(44.49,80.3) v2(45.67,76.9) v2(46.25,69.54) v2(71.73,60.34) v2(72.59,89.56) v2(72.86,54.68) v2(73.2,81.05) v2(74.07,58.11) v2(74.9,87.22) v2(75.48,92.38) v2(77.4,66.02) v2(81.37,54.14) v2(81.91,63.8) v2(83.34,92.37) v2(85.31,54.52) v2(86.49,66.04) v2(86.79,90.08) v2(88.73,51.26) v2(89.55,92.94) v2(89.84,62.64) v2(90.75,54.47) v2(91.29,88.99) v2(91.57,81.98) v2(92.1,60.35) v2(94.37,51.34)
VBAT.SENSE: length 15
  Top Layer w0.127: 57.81,81.46 58.19,81.46 59.97,79.68 ; 55.18,81.84 55.9,81.84 58.06,79.68 59.97,79.68 ; 55.18,81.84 R21.1 ; 55.18,81.84 R22.2 ; 59.97,79.68 60.6,79.05 60.6,75.46 U2.1
VBUS: length 39
  Top Layer w0.2: 80.18,22.4 80.93,21.65 80.93,15.54 ; 80.18,22.4 U7.6 ; 80.18,22.4 80.18,21.78 C14.1 ; 80.93,15.54 81.94,14.53 ; 80.93,15.54 79.78,14.4 ; 73.69,17.07 76.48,14.28 ; 73.69,17.07 71.53,19.23 71.53,23.93 72.16,24.56 R31.2 ; 73.69,17.07 R26.2
  Top Layer w0.4: U6.2 71.51,11.98 71.2,11.66 R24.2 70.38,11.66 69.63,11.66 v1(69.62,11.66)
  Bottom Layer w0.4: v1(74.57,14.66) 71.58,11.66 v1(69.62,11.66)
VCC: length 86.6
  Top Layer w0.2: NOREF#17.23 26.31,77.77 26.82,77.27
  Top Layer w0.4: v1(54.41,83.45) R21.2
  Top Layer w0.5: 27.33,76.38 27.2,76.25 18.19,76.25 17.3,77.14 17.3,85.39 ; v1(35.84,88.95) 35.56,88.95 arc(35.23,88.89) 34.95,88.7 34.93,88.68 arc(34.11,88.13) 33.14,87.94 ; NOREF#41.24 19.84,93.93 arc(18.04,93.19) 17.3,91.39 17.3,85.39 ; 33.14,87.94 19.84,87.94 arc(18.04,87.19) 17.3,85.39 ; 33.14,87.94 37.49,87.94
  Bottom Layer w0.5: v1(54.41,83.45) 54.41,89.46 arc(53.67,91.26) 51.87,92 39.94,92 arc(38.97,91.81) 38.14,91.25 v1(35.84,88.95)
VDD.DEBUG: length 19.8
  Top Layer w2: 25.87,47.69 30.61,47.69 arc(32.4,46.94) 33.15,45.14 33.15,34.09
VIN: length 111.8
  Top Layer w0.2: 28.58,69.27 29.85,68 NOREF#38.23
  Top Layer w0.4: U6.1 71.4,12.63 67.89,16.13 ; 67.28,16.62 arc(67.27,16.62) 67.26,16.62
  Top Layer w0.5: 24.41,57.33 24.41,67.36 arc(24.97,68.71) 26.31,69.27 30.38,69.27 32.63,71.51 C5.1
  Top Layer w0.8: 28.09,58.34 40.67,58.34 arc(42.46,57.59) 43.21,55.8 43.21,27.89 arc(43.01,26.92) 42.46,26.1 41.03,24.67 arc(40.48,23.84) 40.28,22.87 40.28,21.76 arc(41.03,19.97) 42.82,19.22 63.62,19.22 arc(64.59,19.03) 65.41,18.48 67.28,16.62
AW.NINT: length 35.6
  Top Layer w0.127: 83.76,60.2 83.76,61.31 84.48,62.03 ; 83.76,60.2 U4.10 ; 83.76,60.2 83,60.97 ; v1(77.65,63.25) 78.92,61.98 81.98,61.98 83,60.97 ; 63.78,69.52 63.78,67.47 arc(63.71,67.13) 63.53,66.85 ; 63.78,69.52 63.78,70.12 arc(63.7,70.55) 63.45,70.91 U2.12 ; 63.78,69.52 arc(63.87,69.05) 64.14,68.65 69.39,63.41 arc(70.21,62.86) 71.18,62.66 v1(71.78,62.66) ; 83,60.97 81.26,60.97
  Bottom Layer w0.127: v1(71.78,62.66) 72.37,63.25 v1(77.65,63.25)
C0: length 20.9
  Top Layer w0.127: 103.76,74.57 102.87,74.57 101.25,72.95 101.25,62.41 97.66,58.82 R11.1
C1: length 16
  Top Layer w0.127: 104.02,66.62 103.18,66.62 102.77,66.22 102.77,60.88 97.7,55.82 R12.1
C2: length 9.4
  Top Layer w0.127: 103.78,55.68 101.37,55.68 98.51,52.82 R13.2
C3: length 25.8
  Top Layer w0.127: 103.77,82.17 101.83,82.17 99.59,79.93 99.59,64.31 97.1,61.82 R10.1
C4: length 29.8
  Top Layer w0.127: 103.94,88.36 100.53,88.36 97.94,85.78 97.94,65.84 96.92,64.82 R9.1
DEBUG.TX: length 174.1
  Top Layer w0.127: NOREF#33.22 58.45,90.08 arc(58.89,89.01) 59.96,88.57 ; U2.20 62.51,75.85 62.51,87.17 arc(62.1,88.16) 61.11,88.57 59.96,88.57 ; 59.96,88.57 57.68,88.57 arc(56.97,88.87) 56.67,89.59 56.67,91.87 arc(56.37,92.59) v1(55.65,92.89)
  Top Layer w0.254: SW4.3 35.12,19.99 arc(35.31,20.97) 35.86,21.79 40.05,25.98 arc(40.6,26.8) 40.79,27.77 v1(40.79,53.52)
  Bottom Layer w0.254: v1(55.65,92.89) 18.95,92.89 arc(17.15,92.14) 16.41,90.35 16.41,63.93 arc(17.15,62.14) 18.95,61.39 37.62,61.39 arc(39.41,60.65) 40.16,58.85 40.16,54.15 arc(40.34,53.7) v1(40.79,53.52)
DEBUG.TX.CHG: length 62.2
  Top Layer w0.2: 76.27,26.87 75.03,28.12 NOREF#3.23 ; 76.27,26.87 55.58,26.87 arc(54.61,26.68) 53.79,26.13 51.44,23.78 arc(50.62,23.23) 49.65,23.04 v1(43.59,23.04) ; 76.27,26.87 U7.19
  Top Layer w0.254: SW4.1 30.62,8.8 arc(30.88,9.44) 31.52,9.7 v1(31.9,9.7)
  Bottom Layer w0.254: v1(31.9,9.7) 32.38,9.7 arc(33.35,9.9) 34.17,10.45 42.84,19.12 arc(43.39,19.94) 43.59,20.91 v1(43.59,23.04)
DEBUG.TX.PROBE: length 35.4
  Top Layer w0.254: SW4.2 33.62,17.26 arc(33.38,17.84) 32.79,18.09 31.63,18.09 arc(31.62,18.08) NOREF#34.5 arc(31.62,18.08) 31.61,18.09 30.12,18.09 arc(29.41,17.79) 29.11,17.07 29.11,14.82 arc(28.92,13.85) 28.36,13.02 24.27,8.92 arc(23.44,8.37) 22.47,8.18 17.68,8.18 arc(17.14,7.96) 16.92,7.42 NOREF#36.5
GPIO0: length 2.7
  Top Layer w0.127: NOREF#40.22 63.84,73.52 arc(63.34,73.42) U2.15
GPIO1: length 3.2
  Top Layer w0.127: U2.16 64.44,75.52 NOREF#21.22
GPIO2: length 4.9
  Top Layer w0.127: NOREF#39.22 64.67,77.52 64.41,77.27 64.41,76.06 62.64,74.28
GPIO3: length 6.3
  Top Layer w0.127: NOREF#22.22 63.91,77.93 63.91,76.12 U2.18
GPIO4: length 3.5
  Top Layer w0.127: 59.21,77.77 60.22,76.76 60.22,75.27 60.65,74.85
IO0: length 4.5
  Top Layer w0.2: NOREF#46.23 82.07,21.64 U7.8
IO1: length 7
  Top Layer w0.2: NOREF#19.23 85.37,22.91 81.36,22.91 80.49,23.78
IO3: length 4.8
  Top Layer w0.2: U7.12 81.49,26.34 83.75,26.34 NOREF#23.23
IO4: length 7.4
  Top Layer w0.2: NOREF#43.23 85.15,26.94 81.53,26.94 80.21,25.62
IO5: length 10
  Top Layer w0.2: U7.14 81.5,27.48 86.61,27.48 NOREF#44.23
IO6: length 8.5
  Top Layer w0.2: U7.2 77.46,23.44 76,23.44 74.57,22.02 74.57,18.21 75.08,17.7
L1: length 45.1
  Top Layer w0.102: 57.01,42.89 57.67,42.89 ; 57.67,42.89 57.81,42.75 LED23.1 57.81,41.42 57.62,41.24 ; 57.67,42.89 57.81,43.03 LED8.1 ; 57.62,41.24 57.81,41.05 LED28.1 ; 57.62,41.24 57.4,41.02 LED18.1 57.01,40.61 56.6,40.2 54.51,40.2 54.47,40.25 R15.2 54.44,40.67
  Top Layer w0.127: U2.7 58.99,71.76 58.99,56.13 arc(58.79,55.15) 58.24,54.33 53.35,49.44 arc(52.8,48.61) 52.6,47.64 52.6,43.54 arc(52.64,43.37) 52.73,43.23 arc(52.92,42.95) 52.98,42.62 52.98,42.1 arc(52.99,42.01) 53.01,41.92 ; 53.18,41.64 53.87,40.95 arc(54.14,40.77) R15.2 ; 53.18,41.64 arc(53.08,41.77) 53.01,41.92 ; 53.18,41.64 arc(53.08,41.77) 53.01,41.92
L2: length 57.2
  Top Layer w0.102: 63.86,43.69 64.38,43.17 LED19.1 ; 63.86,43.69 64.44,43.69 v3(64.92,44.17) ; 63.86,43.69 LED3.1 63.37,43.95 63.16,44.15 LED14.1 ; 59.41,42.15 59.62,42.37 v3(59.78,42.37) ; 59.41,42.15 59.41,42.89 ; 59.41,42.15 59.41,41.82 ; R16.2 54.47,42.58 54.65,42.4 v3(56.05,42.4)
  Top Layer w0.127: 60.65,72.29 59.75,71.39 59.75,55.11 arc(59.55,54.14) 59,53.31 54.49,48.8 arc(53.94,47.98) 53.75,47 53.75,44.17 arc(53.83,43.74) 54.08,43.38 R16.2
  Bottom Layer w0.102: v3(64.92,44.17) 64.62,43.87 63.53,43.87 62.13,45.26 55.78,45.26 55.4,44.88 55.4,43.05 v3(56.05,42.4) 56.63,42.98 59.17,42.98 v3(59.78,42.37)
L3: length 43.7
  Top Layer w0.102: v3(60.42,42.36) 60.76,42.36 60.97,42.57 ; 61.76,41.63 61.58,41.82 ; 61.76,41.63 61.95,41.82 63.36,41.82 ; 61.76,41.63 LED9.1 ; 61.58,41.82 LED30.1 ; 61.58,41.82 61.76,42 61.76,42.35 61.18,42.35 60.97,42.57 ; 60.97,42.57 60.97,42.89 ; R17.2 55.05,43.55 v3(55.97,43.55)
  Top Layer w0.127: R17.2 54.47,46.83 arc(54.66,47.81) 55.21,48.63 59.39,52.81 arc(59.94,53.63) 60.13,54.6 60.13,71.21 U2.10
  Bottom Layer w0.102: v3(55.97,43.55) 57.37,43.55 57.94,44.12 58.81,44.12 60.42,42.51 v3(60.42,42.36)
L4: length 53.9
  Top Layer w0.102: v3(65.88,42.18) 66.24,41.82 ; 66.24,41.82 67.55,41.82 67.72,41.99 ; 66.24,41.82 66.2,41.82 65.93,41.54 LED31.1 ; 69.32,41.82 67.89,41.82 67.72,41.99 ; 53.8,42.55 v3(53.8,42.25) 54.1,42.25 ; 67.72,41.99 LED15.1 67.16,42.35 66.92,42.59 LED26.1
  Top Layer w0.127: U2.8 59.37,71.58 59.37,55.62 arc(59.17,54.65) 58.62,53.82 53.98,49.18 arc(53.43,48.36) 53.24,47.39 53.24,43.84 arc(53.37,43.16) 53.76,42.58 54.47,41.88 R18.2
  Bottom Layer w0.102: v3(65.88,42.18) 65.15,41.45 60.7,41.45 60.25,41 57,41 56.3,41.7 53.94,41.7 53.8,41.84 v3(53.8,42.25)
L5: length 65.5
  Top Layer w0.102: LED32.1 v3(68.52,41.25) ; 70.87,44 70.72,44.15 70.4,44.15 ; 70.87,44 LED11.1 ; 70.87,44 71.05,44.17 71.65,44.17 LED6.1 ; 70.4,44.15 69.5,44.15 69.32,43.97 ; 70.4,44.15 v3(70.05,43.8) ; LED21.1 69.13,44.15 69.32,43.97 ; 69.32,43.97 69.32,43.69
  Top Layer w0.127: U2.6 58.6,71.95 58.6,56.63 arc(58.41,55.66) 57.86,54.84 52.71,49.69 arc(52.16,48.87) 51.97,47.89 51.97,44.01 ; 51.97,44.01 51.97,43.72 arc(52.04,43.39) 52.22,43.1 arc(52.38,42.87) 52.44,42.59 R19.2 ; 51.97,44.01 arc(51.88,44.47) 51.62,44.86 v3(51.35,45.12)
  Bottom Layer w0.102: v3(70.05,43.8) 70.05,42.78 v3(68.52,41.25) 67.57,40.31 65.88,40.31 65.25,40.94 61,40.94 60.55,40.5 54.5,40.5 53.65,41.35 53,41.35 52.73,41.61 52.73,42.69 arc(52.54,43.67) 51.99,44.49 v3(51.35,45.12)
L6: length 65.6
  Top Layer w0.102: 73.04,42.35 73.27,42.59 LED7.1 ; 73.04,42.35 LED12.1 LED27.1 72.47,40.17 72.3,40 71.05,40 70.87,40.17 LED17.1 v3(70.2,41.02) ; 73.04,42.35 73.27,42.12 LED22.1 ; 51.29,43.4 arc(51.29,43.41) 51.29,43.41
  Top Layer w0.127: 51.29,43.18 51.29,43.56 arc(51.2,44) 50.95,44.37 50.88,44.45 arc(50.75,44.65) 50.7,44.88 50.7,45.16 arc(50.77,45.49) 50.95,45.77 arc(51.2,46.15) 51.29,46.59 51.29,48.02 arc(51.48,48.95) 52.01,49.75 57.48,55.22 arc(58.03,56.04) 58.22,57.02 58.22,72.43 U2.5 ; 51.29,43.18 51.29,41.53 ; 51.29,43.18 arc(51.31,43.07) 51.38,42.97 51.85,42.5 v3(51.85,42.25)
  Bottom Layer w0.102: v3(70.2,41.02) 68.48,39.29 53.45,39.29 51.85,40.9 v3(51.85,42.25)
LED_R: length 32.8
  Top Layer w0.2: R32.1 102.54,25.96 92.1,25.96 88.54,29.52 78.24,29.52 76.86,28.14 76.86,26.85 78.09,25.62
LED_W1: length 15.3
  Top Layer w0.2: U7.7 83.03,20.12 87.53,20.12 89.38,21.97 91.46,21.97 R33.1
LED_W2: length 31.3
  Top Layer w0.2: R27.1 98.1,25.32 91.84,25.32 88.28,28.88 78.5,28.88 77.5,27.87 77.5,26.78 U7.17
LED_W3: length 27.1
  Top Layer w0.2: U7.16 78.13,26.71 78.13,27.61 78.77,28.25 88.02,28.25 91.57,24.69 96.24,24.69 R28.1
LED_W4: length 19.1
  Top Layer w0.2: U7.11 81.29,25.58 82.07,25.58 83.59,24.05 94.37,24.05 R29.1
LED_W5: length 15.8
  Top Layer w0.2: R30.1 92.51,23.42 81.42,23.42 80.77,24.07
NFAULT: length 20.2
  Top Layer w0.2: v1(78.89,22.15) 78.89,22.69 U7.5 ; U6.3 71.75,11.33 71.22,10.79 R24.1
  Top Layer w0.4: v1(70.38,10.03) R24.1
  Bottom Layer w0.2: v1(78.89,22.15) 78.89,21.39 75.72,18.21 75.72,13.89 71.86,10.03 v1(70.38,10.03)
RTC.NINT: length 43.3
  Top Layer w0.127: 84.32,83.62 84.04,83.9 U1.10 ; 84.32,83.62 83.17,82.47 81.81,82.47 80.16,80.82 77.88,80.82 72.03,74.98 arc(71.66,74.42) 71.53,73.75 71.53,73.08 ; 84.32,83.62 84.99,83.62 85.37,84 85.37,85.04 ; U2.11 62.02,71.78 arc(62.57,70.96) 62.76,69.98 62.76,69.52 arc(62.65,68.93) 62.31,68.44 v1(61.62,67.74) 61.62,66.38 arc(61.81,65.41) 62.37,64.58 NOREF#42.22
  Bottom Layer w0.127: v1(71.53,72.95) 71.53,71.97 arc(71.33,71) 70.78,70.17 69.1,68.49 arc(68.27,67.94) 67.3,67.74 v1(61.62,67.74)
RTC.VOUT: length 5.4
  Top Layer w0.127: C1.1 81.94,89.2 81.72,89.43 NOREF#31.23
  Top Layer w0.4: U1.2 83.34,89.17
SCL: length 58.7
  Top Layer w0.127: 68.17,70.41 66.14,70.41 arc(65.17,70.6) 64.34,71.15 63.27,72.22 ; 68.17,70.41 arc(69.14,70.22) 69.97,69.66 80.53,59.1 U4.1 ; 68.17,70.41 arc(68.68,71.17) 68.86,72.07 68.86,72.95 arc(68.98,73.54) 69.31,74.03 75.46,80.19 ; 78.55,87.01 76.83,87.01 75.46,85.65 75.46,80.19 ; 78.55,87.01 U1.5 ; 78.55,87.01 77.48,88.07 NOREF#16.23 ; NOREF#7.22 64.9,71.55 arc(64.02,71.73) 63.27,72.22 ; 63.27,72.22 62.64,72.86 ; 75.46,80.19 76.35,81.08 R1.1
SDA: length 57
  Top Layer w0.127: NOREF#8.22 67.35,68.63 arc(66.38,68.82) 65.56,69.38 64.82,70.11 ; 77.62,81.46 77.62,81.44 70.52,74.34 arc(70.32,74.05) v1(70.26,73.71) ; 77.62,81.46 79.66,81.46 81.94,83.74 U1.7 ; 77.62,81.46 R2.1 ; 64.82,70.11 64.54,70.39 ; 64.82,70.11 arc(65.27,69.43) v1(65.43,68.63) ; 64.54,70.39 U2.13 ; 64.54,70.39 arc(65.36,69.84) 66.34,69.65 68.17,69.65 arc(69.14,69.45) 69.97,68.9 80.17,58.7 U4.2
  Bottom Layer w0.127: v1(65.43,68.63) 66.79,68.63 arc(67.76,68.82) 68.59,69.38 69.51,70.3 arc(70.06,71.12) 70.26,72.1 v1(70.26,73.71)
SENSE: length 65.3
  Top Layer w0.2: 75.84,25.7 74.69,24.56 R31.1 ; 75.84,25.7 76.87,25.7 U7.20 ; 75.84,25.7 v1(72.42,25.7) ; 49.69,57.14 49.69,55.34 arc(49.49,54.37) 48.94,53.54 45.94,50.54 arc(45.61,50.04) 45.49,49.45 45.49,30.78 arc(46.24,28.99) 48.03,28.25 v1(69.88,28.25)
  Bottom Layer w0.2: v1(72.42,25.7) v1(69.88,28.25)
SWIO: length 2.3
  Top Layer w0.2: v1(79.02,27.23) 79.91,27.23 80.16,26.97 80.16,26.71 U7.15
TX: length 17.2
  Top Layer w0.254: NOREF.4 23.23,6.02 arc(24.2,6.21) 25.03,6.76 30.88,12.62 arc(31.43,13.44) 31.62,14.41 NOREF#12.4
UPDI: length 162.4
  Top Layer w0.127: 62.07,74.85 63.4,76.18 63.4,89.97 ; v1(56.79,93.78) 61.19,93.78 arc(62.75,93.13) 63.4,91.57 63.4,89.97 ; 63.4,89.97 arc(62.84,91.31) NOREF#25.22
  Top Layer w0.254: NOREF#27.2 33,25.7 arc(33.97,25.89) 34.8,26.44 38.02,29.66 arc(38.57,30.48) 38.76,31.46 v1(38.76,53.52)
  Bottom Layer w0.254: v1(38.76,53.52) arc(39.21,53.7) 39.4,54.15 39.4,58.09 arc(38.65,59.89) 36.86,60.63 18.19,60.63 arc(16.39,61.37) 15.65,63.17 15.65,91.2 arc(16.39,93) 18.19,93.74 56.58,93.74 56.67,93.65 arc(56.76,93.69) v1(56.79,93.78)
VSET: length 4.8
  Top Layer w0.127: 35.41,76.05 36.48,74.98 U3.7 ; 35.41,76.05 35.84,76.48 35.84,77.01 ; 35.41,76.05 33.94,76.05
$1N3166: length 10
  Top Layer w0.127: 36.86,68.88 36.48,69.26 36.48,70.91 ; U3.2 36.48,70.91 ; 36.48,70.91 38.51,68.88 R4.2
$1N3167: length 8.8
  Top Layer w0.127: 37.51,71.02 38.25,70.28 R6.2 ; 37.51,71.02 39.75,71.02 39.9,71.17 ; 37.51,71.02 36.98,71.56 U3.3
$1N3187: length 1.3
  Top Layer w0.127: R8.1 LED2.2
$1N3197: length 10.3
  Top Layer w0.127: LED2.1 33.43,77.77 34.57,78.92 36.47,78.92 37.48,77.91 U3.5
$1N3198: length 1.3
  Top Layer w0.127: LED1.2 30.86,76.25 R7.1
$1N3199: length 9.9
  Top Layer w0.127: LED1.1 32.66,76.25 34.82,78.41 36.22,78.41 36.98,77.65 U3.6
$1N3232: length 11.7
  Top Layer w0.127: U4.6 84.55,57.5 86.23,55.82 R12.2
$1N3233: length 12
  Top Layer w0.127: U4.7 85.31,57.9 86.13,57.07 91.59,57.07 93.34,58.82 R11.2
$1N3236: length 12.4
  Top Layer w0.127: R10.2 91.64,61.82 88.12,58.3 U4.8
$1N3237: length 15.1
  Top Layer w0.127: U4.9 85.47,58.7 87.28,60.5 87.28,63.3 88.8,64.82 R9.2
$1N3255: length 17.2
  Top Layer w0.127: U4.3 82.86,58.3 82.98,58.17 82.98,54 84.16,52.82 R13.1
$1N4483: length 4.4
  Top Layer w0.2: U7.1 77.25,23.8 75.59,23.8 74.37,22.58 R26.1
$1N4489: length 2.1
  Top Layer w0.2: R33.2 93.98,20.67 LED38.2
$1N4492: length 2.1
  Top Layer w0.2: LED33.2 103.98,20.67 R27.2
$1N4495: length 2.1
  Top Layer w0.2: R28.2 101.48,20.67 LED34.2
$1N4498: length 2.1
  Top Layer w0.2: R29.2 98.98,20.67 LED35.2
$1N4501: length 2.1
  Top Layer w0.2: R30.2 96.48,20.67 LED36.2
$1N4505: length 1.5
  Top Layer w0.2: R32.2 105.69,25.71
$1N4813: length 30.4
  Top Layer w0.102: R15.1 55.85,40.7 56,40.85 v3(56,41.2) ; LED3.2 63.56,42.89 64.35,42.1 ; LED4.2 63.92,41.02 64.35,41.45 64.35,42.1 ; v3(72.47,43.35) 72.47,43.35 LED6.2 73.12,44.15 73.27,44 LED7.2 ; 64.35,42.1 64.99,42.1 65.13,41.97 65.13,41.15 65.26,41.02 LED5.2 67.1,41.02 67.36,41.27 v3(67.68,41.27)
  Bottom Layer w0.102: v3(56,41.2) 56,40.87 56.12,40.75 60.4,40.75 60.85,41.2 65.35,41.2 65.8,40.75 67.16,40.75 v3(67.68,41.27) 69.1,42.69 69.1,43.8 69.7,44.4 71.42,44.4 v3(72.47,43.35)
$1N4816: length 45.5
  Top Layer w0.102: 58.6,44.6 59.39,45.39 73.31,45.39 74.32,44.37 74.32,40.69 73.31,39.67 ; 58.6,44.6 58.6,44.17 LED8.2 ; 58.6,44.6 58.45,44.75 56.77,44.75 56.45,44.42 56.45,43.2 56.24,42.99 R16.1 ; 69.32,40.11 LED10.2 ; 69.32,40.11 69.32,39.98 ; 69.32,40.11 69.25,40.05 ; 71.28,42.89 71.67,42.5 LED12.2 ; 71.28,42.89 71.34,42.89 v3(71.68,43.22) 71.62,43.22 ; 71.28,42.89 LED11.2 ; 73.31,39.67 v3(73.31,40.18) ; 73.31,39.67 72.92,39.29 70,39.29 69.32,39.98 ; 69.32,39.98 69.25,40.05 ; LED9.2 62.89,40.55 63.24,40.21 v3(63.24,40.16) ; 69.25,40.05 64.75,40.05 v3(64.48,39.77)
  Bottom Layer w0.102: v3(64.48,39.77) 63.62,39.77 v3(63.24,40.16) ; v3(73.31,40.18) 73.31,41.59 v3(71.68,43.22)
$1N4817: length 27.4
  Top Layer w0.102: v3(62.19,43.07) 62.44,43.07 62.56,42.95 ; 67.72,44.34 67.42,44.64 66.04,44.64 65.53,44.12 LED19.2 65.53,42.77 65.35,42.6 64.52,42.6 63.83,43.28 62.9,43.28 62.56,42.95 ; 67.72,44.34 67.75,44.31 ; 67.72,44.34 68.03,44.65 73.51,44.65 73.9,44.26 73.9,41.25 73.67,41.02 LED22.2 ; 67.72,44.34 67.72,44.34 LED21.2 ; 62.56,42.95 LED20.2 ; R18.1 56.98,41.84 LED18.2 v3(57.01,42.29)
  Bottom Layer w0.102: v3(57.01,42.29) 57.01,42.3 58.85,42.3 59.44,41.71 61.61,41.71 62.19,42.29 v3(62.19,43.07)
$1N4818: length 21.7
  Top Layer w0.102: v3(60.95,44.29) 61.08,44.15 61.76,44.15 ; 70.87,41.82 70.38,41.82 69.84,42.35 69.56,42.35 ; LED13.2 v3(57.01,44.18) ; 69.56,42.35 LED15.2 68.52,42.53 68.09,42.95 67.65,42.95 67.31,43.3 66.3,43.3 66.1,43.1 v3(66.1,42.75) ; 69.56,42.35 69.32,42.59 LED16.2 ; v3(55.97,44.19) 55.39,44.19 R17.1
  Bottom Layer w0.102: v3(55.97,44.19) v3(57.01,44.19) 57.46,44.63 58.92,44.63 59.68,43.87 60.53,43.87 v3(60.95,44.29) 62.31,44.29 62.75,43.85 62.75,42.24 63.08,41.91 64.31,41.91 65.15,42.75 v3(66.1,42.75)
$1N4825: length 38.9
  Top Layer w0.102: v3(66.15,44) 66.46,43.69 67.36,43.69 67.75,43.3 69.95,43.3 70.15,43.1 70.15,42.55 70.35,42.35 v3(70.9,42.35) ; 60.97,43.69 59.27,43.69 58.61,43.03 ; 58.61,43.03 58.61,43.24 v3(58.35,43.5) ; 58.61,43.03 LED23.2 ; R19.1 52.45,40.73 v3(53.03,40.73) ; LED25.2 61.11,43.69 61.21,43.59 61.94,43.59 62.16,43.81 62.16,44.55 62.31,44.69 63.76,44.69 v3(64.05,44.4) ; LED27.2 v3(71.67,41.3)
  Bottom Layer w0.102: v3(53.03,40.73) 53.52,40.25 60.65,40.25 61.09,40.69 65.1,40.69 65.99,39.8 68.1,39.8 69.9,41.6 71.1,41.6 ; v3(70.9,42.35) 70.9,41.8 71.1,41.6 ; 71.1,41.6 71.39,41.3 v3(71.67,41.3) ; v3(66.15,44) 65.26,44.88 64.53,44.88 v3(64.05,44.4)
$1N5378: length 21.2
  Top Layer w0.102: LED30.2 60.96,40.33 ; 60.96,40.33 61.62,39.67 63.43,39.67 64.73,40.97 64.73,41.11 ; 60.96,40.33 59.79,40.33 ; 59.41,40.71 LED29.2 ; 59.41,40.71 59.79,40.33 ; 59.41,40.71 59.25,40.55 LED28.2 ; 59.79,40.33 59.4,39.95 51.5,39.95 51.29,40.15 R20.1 ; 64.73,41.11 LED31.2 ; 64.73,41.11 65.09,40.75 66.05,40.75 66.24,40.55 LED32.2

## Copper pours and planes (outline as drawn; the poured copper is in the pictures)
3.0V on Top Layer: 83.85,88.95 89.42,88.95 89.42,85.91 83.85,85.91
3.0V on Top Layer: 56.44,74.97 58.68,74.97 58.68,73.91 56.44,73.91
3.0V on Top Layer: 39.47,87.74 43.29,87.74 43.29,86.79 39.47,86.79
3.0V on Top Layer: 76.23,60.47 79.87,60.47 79.87,57.58 76.23,57.58
3.0V on Top Layer: 76.1,86.22 82.64,86.22 82.64,83.29 76.1,83.29
3.0V on Top Layer: 71.98,70.51 74.7,70.51 74.7,67.79 71.98,67.79
3.0V on Top Layer: 68.8,67.34 71.53,67.34 71.53,64.61 68.8,64.61
3.0V on Bottom Layer: 71.98,70.51 74.7,70.51 74.7,67.79 71.98,67.79
3.0V on Bottom Layer: 68.8,67.34 71.53,67.34 71.53,64.61 68.8,64.61
5V_IN on Top Layer: 51.26,14.14 50.5,14.45 50.19,15.21 50.19,16.04 50,16.49 49.55,16.68 48.95,16.68 48.57,16.52 48.41,16.14 48.41,12.2 48.59,11.77 49.01,11.59 54.37,11.59 55.88,11.29 57.16,10.44 56.99,11.26 56.53,11.95 55.39,13.09 54.87,13.44 54.25,13.56 53.62,13.99 52.87,14.14
5V_IN on Top Layer: 78.33,11.54 80.43,11.54 80.43,8.86 78.33,8.86
5V_IN on Top Layer: 20.56,46.97 28.63,46.97 28.63,43.9 20.56,43.9
GND on Top Layer: 91.94,18.77 105.23,18.77 105.23,17.45 91.94,17.45
GND on Top Layer: 57.41,76.24 59.79,76.24 59.79,74.93 57.41,74.93
GND on Top Layer: 76.84,22.83 79.49,22.83 79.49,20.34 76.84,20.34
GND on Top Layer: 73.66,12.72 78.02,12.72 78.02,10.52 73.66,10.52
GND on Top Layer: 16.97,44.89 20.16,44.89 20.16,42.42 16.97,42.42
GND on Top Layer: 72.03,92.38 72.05,92.63 72.11,92.87 72.21,93.11 72.34,93.32 72.5,93.51 72.69,93.67 72.91,93.81 73.14,93.9 73.38,93.96 73.63,93.98 90.5,93.98 90.75,93.96 91,93.9 91.23,93.81 91.44,93.67 91.63,93.51 91.8,93.32 91.93,93.11 92.02,92.87 92.08,92.63 92.1,92.38 92.1,79.63 92.08,79.38 92.02,79.13 91.93,78.9 91.8,78.69 91.63,78.5 91.44,78.33 91.23,78.2 91,78.11 90.75,78.05 90.5,78.03 73.63,78.03 73.38,78.05 73.14,78.11 72.91,78.2 72.69,78.33 72.5,78.5 72.34,78.69 72.21,78.9 72.11,79.13 72.05,79.38 72.03,79.63
GND on Top Layer: 26.52,6.63 28.99,6.63 28.99,3.44 26.52,3.44
GND on Top Layer: 18.62,81.17 18.64,81.42 18.7,81.66 18.8,81.9 18.93,82.11 19.09,82.3 19.28,82.46 19.5,82.59 19.73,82.69 19.97,82.75 20.22,82.77 45.73,82.77 45.98,82.75 46.22,82.69 46.46,82.59 46.67,82.46 46.86,82.3 47.02,82.11 47.15,81.9 47.25,81.66 47.31,81.42 47.33,81.17 47.33,64.43 47.31,64.18 47.25,63.93 47.15,63.7 47.02,63.49 46.86,63.3 46.67,63.13 46.46,63 46.22,62.91 45.98,62.85 45.73,62.83 20.22,62.83 19.97,62.85 19.73,62.91 19.5,63 19.28,63.13 19.09,63.3 18.93,63.49 18.8,63.7 18.7,63.93 18.64,64.18 18.62,64.43
GND on Top Layer: 25.15,74.47 41.56,74.47 41.56,70.28 25.15,70.28
GND on Top Layer: 77.5,20.5 79.12,20.5 79.12,17.96 77.5,17.96
GND on Top Layer: 36.75,6.62 39.22,6.62 39.22,3.43 36.75,3.43
GND on Top Layer: 16.97,54.93 24.22,54.93 24.22,52.49 16.97,52.49
GND on Top Layer: 70.28,65.38 70.3,65.63 70.36,65.87 70.45,66.11 70.58,66.32 70.75,66.51 70.94,66.67 71.15,66.81 71.38,66.9 71.63,66.96 71.88,66.98 96.34,66.98 96.59,66.96 96.84,66.9 97.07,66.81 97.28,66.67 97.47,66.51 97.64,66.32 97.77,66.11 97.86,65.87 97.92,65.63 97.94,65.38 97.94,51.89 97.92,51.64 97.86,51.4 97.77,51.16 97.64,50.95 97.47,50.76 97.28,50.6 97.07,50.47 96.84,50.37 96.59,50.31 96.34,50.29 71.88,50.29 71.63,50.31 71.38,50.37 71.15,50.47 70.94,50.6 70.75,50.76 70.58,50.95 70.45,51.16 70.36,51.4 70.3,51.64 70.28,51.89
GND on Bottom Layer: -6.96,124.22 135.15,124.22 135.15,-4.17 -6.96,-4.17
VBUS on Top Layer: 73.94,14.86 80.43,14.86 80.43,12.43 73.94,12.43
VBUS on Top Layer: 78.38,22.4 80.93,22.4 80.93,14.28 78.38,14.28
VCC on Top Layer: 36.86,88.44 38.92,88.44 38.92,87.3 36.86,87.3
VCC on Top Layer: 25.43,78.03 36.09,78.03 36.09,74.03 25.43,74.03
VDD.DEBUG on Top Layer: 21.05,48.69 26.12,48.69 26.12,46.69 21.05,46.69
VDD.DEBUG on Top Layer: 30.16,34.54 34.16,34.54 34.16,27.37 30.16,27.37
VIN on Top Layer: 24.16,60.03 29.69,60.03 29.69,55.63 24.16,55.63
VIN on Top Layer: 67.01,16.88 68.1,16.88 68.1,15.9 67.01,15.9
VIN on Top Layer: 31.46,72.63 36.09,72.63 36.09,70.35 31.46,70.35
VIN.USB on Top Layer: 19.41,54.34 29.67,54.34 29.67,49.77 19.41,49.77
C0 on Top Layer: 103.62,81.11 107.32,81.11 107.32,67.52 103.62,67.52
C1 on Top Layer: 103.62,73.71 107.32,73.71 107.32,64.6 103.62,64.6
C2 on Top Layer: 103.62,58.05 107.32,58.05 107.32,51.51 103.62,51.51
C3 on Top Layer: 103.62,87.86 107.32,87.86 107.32,74.92 103.62,74.92
C4 on Top Layer: 103.85,89.96 107.11,89.96 107.11,82.32 103.85,82.32

Small or netless copper shapes (teardrops, artwork), in the pictures only: 25 on Top Layer, 25 on Bottom Layer

## Text on the board
Bottom Solder Mask Layer: BOARD | LUME
Bottom Silkscreen Layer: Friendly | Project | DEBUGGING
Top Layer: BOARD | LUME
Top Solder Mask Layer: BOARD | LUME
Top Silkscreen Layer: UPDI | VDD | 3V3 | TX | RX | ATtiny1616 | INT | IO6 | IO0 | VBUS | IO3 | IO4 | IO1 | Charging | IO5 | FAULT | VCC | STAT | VIN | PG | VSET | ICH | TS | 3V | TX-DEBUG | RTC | AW | IO2 | SCL | SDA | RTC.VOUT | DEBUGGING | Friendly | LDO | Battery | VBAT | GND | bypass | daugther board | Programmer | ATtiny | CH32 | 2026-06-01 | Silkscreen Studio | Project | CG | TOUCH.AW93105 | CHG.BQ25170 | RTC.RX8111 | Display | +
